# EAGLE design rc2014_rruart (EAGLE 8.1.1)
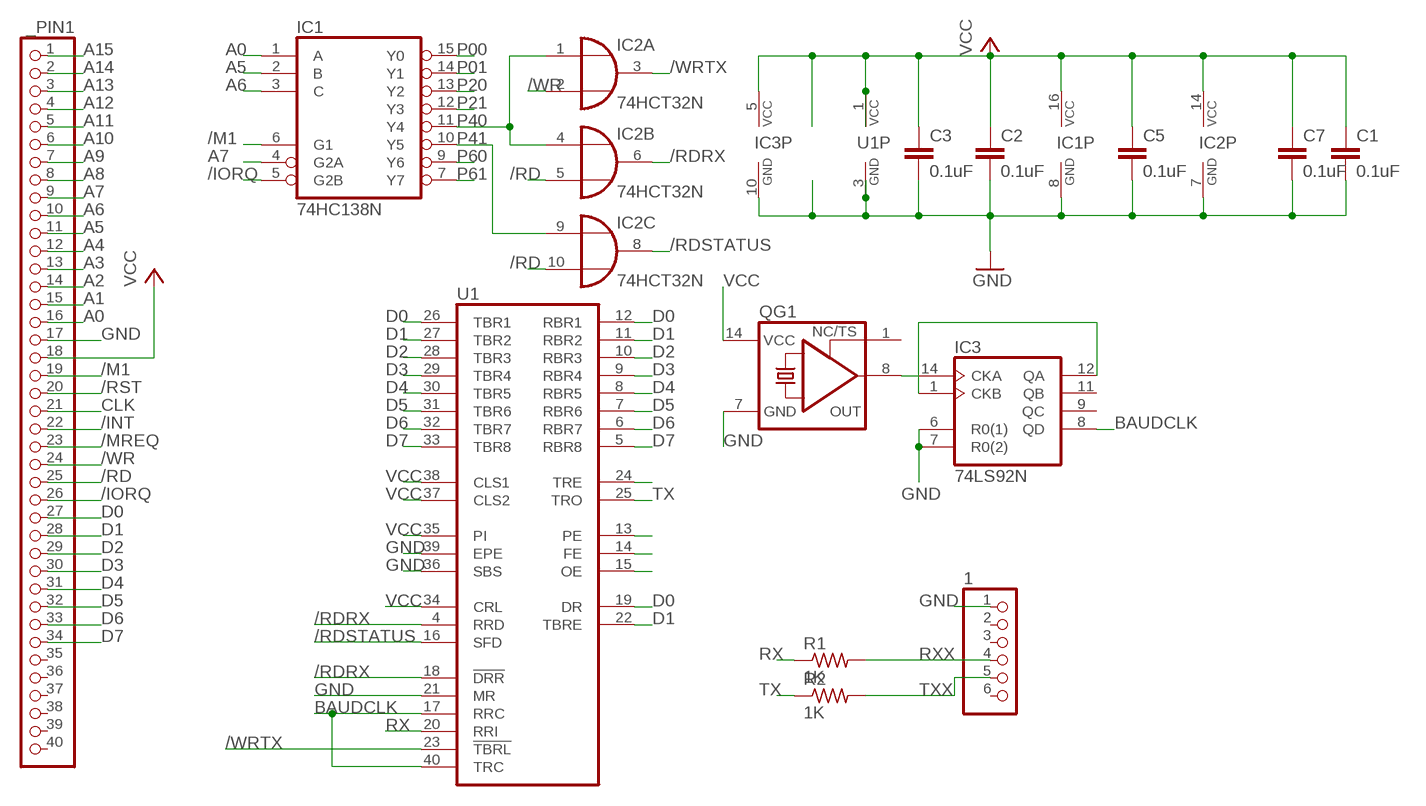
[diagram p0: schematic, sheet 1]

## Parts
1  PINHD-1X6  [1X06]
_PIN1  PINHD-1X40  [1X40]
C1  0.1uF  C-EU050-024X044  [C050-024X044]
C2  0.1uF  C-EU050-024X044  [C050-024X044]
C3  0.1uF  C-EU050-024X044  [C050-024X044]
C5  0.1uF  C-EU050-024X044  [C050-024X044]
C7  0.1uF  C-EU050-024X044  [C050-024X044]
IC1  74HC138N  [DIL16]
IC2  74HCT32N  [DIL14]
IC3  74LS92N  [DIL14]
QG1  XO-14  [DIL14S]
R1  1K  R-US_0207/10  [0207/10]
R2  1K  R-US_0207/10  [0207/10]
U1  HD6402  [DIL40]

## Nets
/INT: _PIN1.22
/IORQ: _PIN1.26 IC1.5(G2B)
/M1: _PIN1.19 IC1.6(G1)
/MREQ: _PIN1.23
/RD: _PIN1.25 IC2.5(B:I1) IC2.10(C:I1)
/RDRX: IC2.6(B:O) U1.4(RRD) U1.18(!DRR)
/RDSTATUS: IC2.8(C:O) U1.16(SFD)
/RST: _PIN1.20
/WR: _PIN1.24 IC2.2(A:I1)
/WRTX: IC2.3(A:O) U1.23(!TBRL)
A0: _PIN1.16 IC1.1(A)
A1: _PIN1.15
A2: _PIN1.14
A3: _PIN1.13
A4: _PIN1.12
A5: _PIN1.11 IC1.2(B)
A6: _PIN1.10 IC1.3(C)
A7: _PIN1.9 IC1.4(G2A)
A8: _PIN1.8
A9: _PIN1.7
A10: _PIN1.6
A11: _PIN1.5
A12: _PIN1.4
A13: _PIN1.3
A14: _PIN1.2
A15: _PIN1.1
BAUDCLK: IC3.8(QD) U1.17(RRC) U1.40(TRC)
CLK: _PIN1.21
D0: _PIN1.27 U1.12(RBR1) U1.19(DR) U1.26(TBR1)
D1: _PIN1.28 U1.11(RBR2) U1.22(TBRE) U1.27(TBR2)
D2: _PIN1.29 U1.10(RBR3) U1.28(TBR3)
D3: _PIN1.30 U1.9(RBR4) U1.29(TBR4)
D4: _PIN1.31 U1.8(RBR5) U1.30(TBR5)
D5: _PIN1.32 U1.7(RBR6) U1.31(TBR6)
D6: _PIN1.33 U1.6(RBR7) U1.32(TBR7)
D7: _PIN1.34 U1.5(RBR8) U1.33(TBR8)
GND: 1.1 _PIN1.17 C1.2 C2.2 C3.2 C5.2 C7.2 IC1.8(GND) IC2.7(P:GND) IC3.6(R0(1)) IC3.7(R0(2)) IC3.10(GND) QG1.7(GND) U1.3(GND) U1.21(MR) U1.36(SBS) U1.39(EPE)
N$2: IC3.14(CKA) QG1.8(OUT)
N$3: IC3.1(CKB) IC3.12(QA)
N$29: U1.15(OE)
N$30: U1.14(FE)
N$31: U1.13(PE)
N$33: U1.24(TRE)
P00: IC1.15(Y0)
P01: IC1.14(Y1)
P20: IC1.13(Y2)
P21: IC1.12(Y3)
P40: IC1.11(Y4) IC2.1(A:I0) IC2.4(B:I0)
P41: IC1.10(Y5) IC2.9(C:I0)
P60: IC1.9(Y6)
P61: IC1.7(Y7)
RX: R1.1 U1.20(RRI)
RXX: 1.4 R1.2
TX: R2.1 U1.25(TRO)
TXX: 1.5 R2.2
VCC: _PIN1.18 C1.1 C2.1 C3.1 C5.1 C7.1 IC1.16(VCC) IC2.14(P:VCC) IC3.5(VCC) QG1.14(VCC) U1.1(VCC) U1.34(CRL) U1.35(PI) U1.37(CLS2) U1.38(CLS1)
Unconnected: 1.2 1.3 1.6 _PIN1.35 _PIN1.36 _PIN1.37 _PIN1.38 _PIN1.39 _PIN1.40 IC2.11(D:O) IC2.12(D:I0) IC2.13(D:I1) IC3.9(QC) IC3.11(QB) QG1.1(TS)

## Library data of the parts
1 = pinhead:PINHD-1X6: PIN HEADER
_PIN1 = pinhead:PINHD-1X40: PIN HEADER
C1-C3 C5 C7 = rcl:C-EU: CAPACITOR, European symbol
IC1 = 74xx-eu:74*138: 3-line to 8-line DECODER/DEMULTIPLEXER
IC2 = 74xx-eu:74*32: Quad 2-input OR gate
IC3 = 74xx-eu:74*92: Decade, divide by twelve and binary COUNTER
QG1 = crystal:XO-: CRYSTAL; OC_FARNELL: unknown; OC_NEWARK: unknown
R1 R2 = resistor:R-US_: RESISTOR, American symbol
U1 = micro-harris:HD6402: MICROCONTROLLER/MEMORY DEVICE; OC_FARNELL: unknown; OC_NEWARK: unknown

## Net classes
0 +5V: width 0.508 mm

## Board
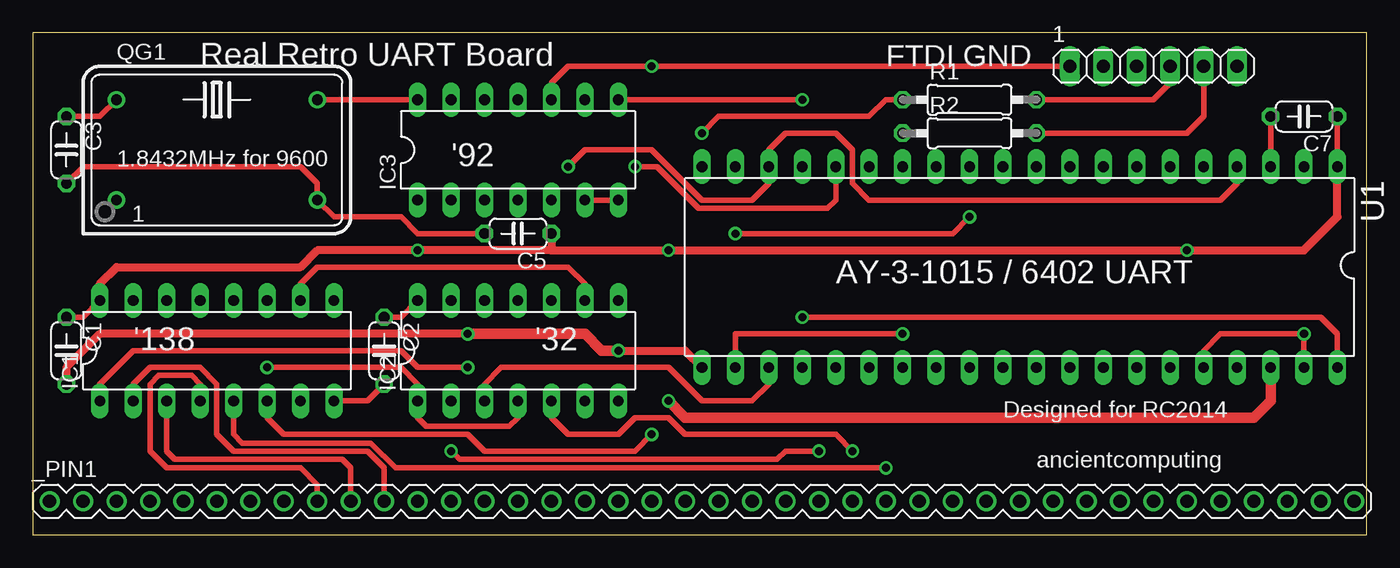
[diagram p1: board, top side]
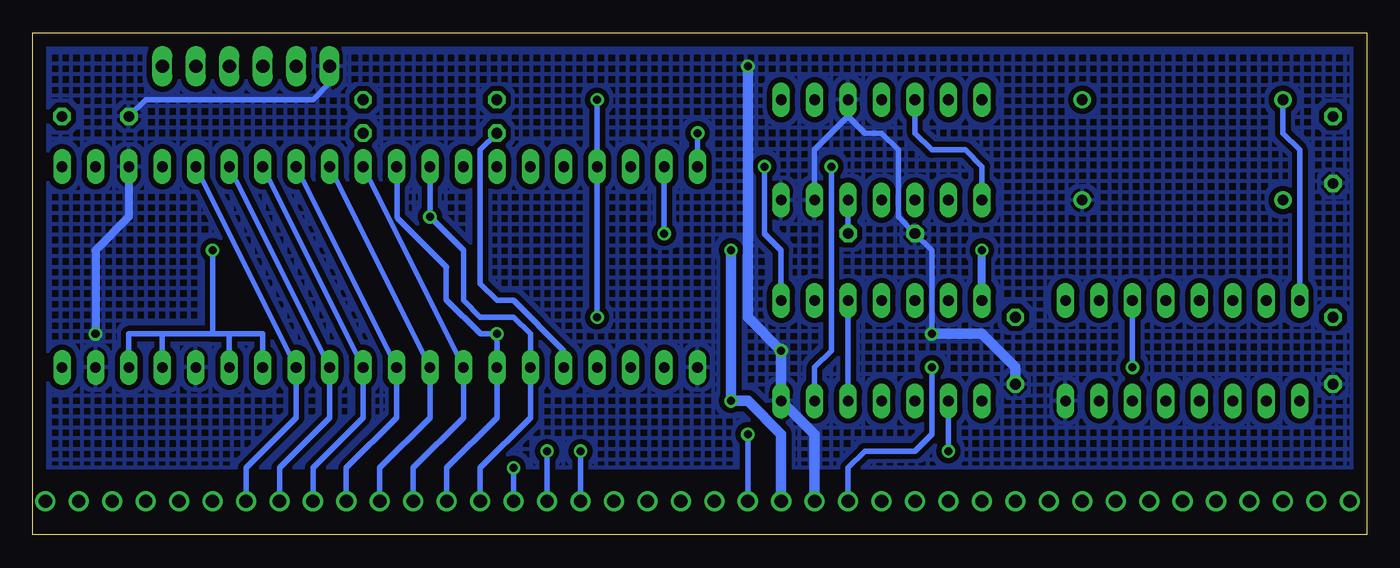
[diagram p2: board, bottom side, seen from below]

Size 101.27 x 38.09 mm. Coordinates in mm from the lower left corner, seen from the top.
Outline: 0,0 101.27,0 101.27,38.09 0,38.09 0,0
Copper layers (1*16): Top 0.035mm / dielectric 1.5mm / Bottom 0.035mm
Design rules "default *": minimum track width 20mil, minimum drill 24mil, track to track 8mil, track to pad 8mil, pad to pad 8mil, via to via 8mil, smd to smd 8mil, copper to edge 40mil, drill to drill 8mil, minimum pad ring 10mil, minimum via ring 8mil, stop-mask expansion 4mil, vias tented up to drill 0mil, thermal gap 10mil

### Footprints (pad centres in the part's own frame; a part is rotated, then mirrored left to right if it is on the bottom)
1X06 = drill 1.016 long: 1 -6.35,0; 2 -3.81,0; 3 -1.27,0; 4 1.27,0; 5 3.81,0; 6 6.35,0
1X40 = drill 1.016: 1 -49.53,0; 2 -46.99,0; 3 -44.45,0; 4 -41.91,0; 5 -39.37,0; 6 -36.83,0; 7 -34.29,0; 8 -31.75,0; 9 -29.21,0; 10 -26.67,0; 11 -24.13,0; 12 -21.59,0; 13 -19.05,0; 14 -16.51,0; 15 -13.97,0; 16 -11.43,0; 17 -8.89,0; 18 -6.35,0; 19 -3.81,0; 20 -1.27,0; 21 1.27,0; 22 3.81,0; 23 6.35,0; 24 8.89,0; 25 11.43,0; 26 13.97,0; 27 16.51,0; 28 19.05,0; 29 21.59,0; 30 24.13,0; 31 26.67,0; 32 29.21,0; 33 31.75,0; 34 34.29,0; 35 36.83,0; 36 39.37,0; 37 41.91,0; 38 44.45,0; 39 46.99,0; 40 49.53,0
C050-024X044 = drill 0.813 octagon: 1 -2.54,0; 2 2.54,0
DIL16 = drill 0.813 long: 1 -8.89,-3.81; 2 -6.35,-3.81; 3 -3.81,-3.81; 4 -1.27,-3.81; 5 1.27,-3.81; 6 3.81,-3.81; 7 6.35,-3.81; 8 8.89,-3.81; 9 8.89,3.81; 10 6.35,3.81; 11 3.81,3.81; 12 1.27,3.81; 13 -1.27,3.81; 14 -3.81,3.81; 15 -6.35,3.81; 16 -8.89,3.81
DIL14 = drill 0.813 long: 1 -7.62,-3.81; 2 -5.08,-3.81; 3 -2.54,-3.81; 4 0,-3.81; 5 2.54,-3.81; 6 5.08,-3.81; 7 7.62,-3.81; 8 7.62,3.81; 9 5.08,3.81; 10 2.54,3.81; 11 0,3.81; 12 -2.54,3.81; 13 -5.08,3.81; 14 -7.62,3.81
DIL14S = drill 0.813: 1 -7.62,-3.81; 7 7.62,-3.81; 8 7.62,3.81; 14 -7.62,3.81
0207/10 = drill 0.813 octagon: 1 -5.08,0; 2 5.08,0
DIL40 = drill 0.813 long: 1 -24.13,-7.62; 2 -21.59,-7.62; 3 -19.05,-7.62; 4 -16.51,-7.62; 5 -13.97,-7.62; 6 -11.43,-7.62; 7 -8.89,-7.62; 8 -6.35,-7.62; 9 -3.81,-7.62; 10 -1.27,-7.62; 11 1.27,-7.62; 12 3.81,-7.62; 13 6.35,-7.62; 14 8.89,-7.62; 15 11.43,-7.62; 16 13.97,-7.62; 17 16.51,-7.62; 18 19.05,-7.62; 19 21.59,-7.62; 20 24.13,-7.62; 21 24.13,7.62; 22 21.59,7.62; 23 19.05,7.62; 24 16.51,7.62; 25 13.97,7.62; 26 11.43,7.62; 27 8.89,7.62; 28 6.35,7.62; 29 3.81,7.62; 30 1.27,7.62; 31 -1.27,7.62; 32 -3.81,7.62; 33 -6.35,7.62; 34 -8.89,7.62; 35 -11.43,7.62; 36 -13.97,7.62; 37 -16.51,7.62; 38 -19.05,7.62; 39 -21.59,7.62; 40 -24.13,7.62

### Placement (x,y rotation side)
1  85.09,35.56 0 top
_PIN1  50.8,2.54 0 top
C1  2.54,13.97 270 top
C2  26.67,13.97 270 top
C3  2.54,29.21 270 top
C5  36.83,22.86 180 top
C7  96.52,31.75 180 top
IC1  13.97,13.97 0 top
IC2  36.83,13.97 0 top
IC3  36.83,29.21 0 top
QG1  13.97,29.21 0 top
R1  71.12,33.02 0 top
R2  71.12,30.48 0 top
U1  74.93,20.32 180 top

### Tracks (layer width: path | path; a pad name or v marks a point on that pad's centre or on a via)
/IORQ  (via drill 0.61)
  Top 0.406: v64.77,5.08 27.53,5.08 25.65,6.96 15.9,6.96 15.24,7.62 IC1.5
  Bottom 0.406: _PIN1.26 v64.77,5.08
/M1  (via drill 0.61)
  Top 0.406: 19.05,7.62 17.78,8.89 IC1.6 | 19.05,7.62 25.85,7.62 | v46.99,7.62 45.72,6.35 34.29,6.35 33.02,7.62 | 33.02,7.62 25.4,7.62 | 19.05,7.62 33.02,7.62
  Bottom 0.406: _PIN1.19 v46.99,7.62
/RD  (via drill 0.61)
  Top 0.406: IC2.5 39.37,8.89 40.64,7.62 44.45,7.62 45.72,8.89 46.99,8.89 | 46.99,8.89 48.26,8.89 | 46.99,8.89 48.26,8.89 | 48.26,8.89 49.53,7.62 60.96,7.62 v62.23,6.35
  Bottom 0.406: IC2.10 IC2.5 | v62.23,6.35 _PIN1.25
/RDRX  (via drill 0.61)
  Top 0.406: v40.64,27.94 41.91,29.21 46.99,29.21 50.8,25.4 54.61,25.4 55.88,26.67 U1.18 55.88,29.21 57.15,30.48 60.96,30.48 62.23,29.21 62.23,26.67 63.5,25.4 90.17,25.4 91.44,26.67 U1.4
  Bottom 0.406: IC2.6 41.91,12.7 40.64,13.97 v40.64,27.94
/RDSTATUS  (via drill 0.61)
  Top 0.406: v45.72,27.94 47.4,27.94 50.55,24.79 60.35,24.79 60.96,25.4 U1.16
  Bottom 0.406: IC2.8 44.45,21.59 45.72,22.86 v45.72,27.94
/WR  (via drill 0.61)
  Top 0.406: v31.75,6.35 32.38,5.71 56.52,5.71 57.15,6.35 v59.69,6.35 58.4,6.35
  Bottom 0.406: _PIN1.24 v59.69,6.35 | IC2.2 v31.75,6.35
/WRTX
  Top 0.406: IC2.3 34.29,11.43 35.56,12.7 48.26,12.7 50.8,10.16 54.61,10.16 55.88,11.43 U1.23
A0  (via drill 0.61)
  Top 0.406: IC1.1 5.08,11.43 7.62,13.97 27.94,13.97 29.21,12.7 v33.02,12.7
  Bottom 0.406: v33.02,12.7 33.02,7.62 34.29,6.35 38.1,6.35 39.37,5.08 _PIN1.16
A5
  Top 0.406: _PIN1.11 26.67,5.08 25.4,6.35 15.24,6.35 13.97,7.62 13.97,11.43 12.7,12.7 8.89,12.7 7.62,11.43 IC1.2
A6
  Top 0.406: _PIN1.10 24.13,5.08 23.47,5.74 10.77,5.74 10.16,6.35 IC1.3
A7
  Top 0.406: _PIN1.9 21.59,3.81 20.32,5.08 10.16,5.08 8.89,6.35 8.89,11.43 9.55,12.09 12.04,12.09 12.7,11.43 IC1.4
BAUDCLK  (via drill 0.61)
  Top 0.406: v58.42,16.51 97.79,16.51 99.06,15.24 U1.40 | IC3.8 v58.42,33.02
  Bottom 0.406: v58.42,16.51 U1.17 v58.42,33.02
D0  (via drill 0.61)
  Top 0.406: v53.34,22.86 69.85,22.86 v71.12,24.13
  Bottom 0.406: _PIN1.27 67.31,5.08 63.5,8.89 U1.26 63.5,15.24 64.77,16.51 67.31,16.51 68.58,17.78 68.58,21.59 v71.12,24.13 U1.12 | U1.19 v53.34,22.86
D1  (via drill 0.61)
  Top 0.406: v66.04,15.24 53.34,15.24 U1.22
  Bottom 0.406: _PIN1.28 69.85,5.08 66.04,8.89 U1.27 v66.04,15.24 67.27,15.24 69.89,17.85 69.89,20.28 69.85,20.32 73.57,24.04 73.62,24.15 73.62,27.9 U1.11
D2
  Bottom 0.406: _PIN1.29 72.39,5.08 68.58,8.89 U1.28 U1.10
D3
  Bottom 0.406: _PIN1.30 74.93,5.08 71.12,8.89 U1.29 U1.9
D4
  Bottom 0.406: _PIN1.31 77.47,5.08 73.66,8.89 U1.30 U1.8
D5
  Bottom 0.406: _PIN1.32 80.01,5.08 76.2,8.89 U1.31 U1.7
D6
  Bottom 0.406: _PIN1.33 82.55,5.08 78.74,8.89 U1.32 U1.6
D7
  Bottom 0.406: _PIN1.34 85.09,5.08 81.28,8.89 U1.33 U1.5
GND  (via drill 0.61)
  Top 0.406: IC1.8 25.4,10.16 C2.2 | IC3.6 IC3.7 | C7.2 U1.3 | C3.2 3.81,27.94 20.32,27.94 21.59,26.67 QG1.7 22.86,24.13 27.94,24.13 29.21,22.86 C5.2 | U1.36 88.9,13.97 90.17,15.24 v96.52,15.24 U1.39 | IC3.10 39.37,34.29 40.64,35.56 v46.99,35.56 1.1
  Top 0.61: v44.45,13.97 49.53,13.97 U1.21 | C1.2 2.54,12.7 5.08,15.24 v33.02,15.24
  Top 0.813: v33.02,15.24 41.91,15.24 43.18,13.97 v44.45,13.97
  Bottom 0.406: v33.02,15.24 33.02,21.59 C5.2 35.56,24.13 35.56,29.21 36.83,30.48 38.1,30.48 39.37,31.75 | 39.37,31.75 IC3.10 | IC3.6 41.91,29.21 39.37,31.75 | C7.2 92.71,33.02 80.01,33.02 78.74,34.29 1.1
  Bottom 0.61: U1.3 93.98,24.13 96.52,21.59 v96.52,15.24
  Bottom 0.813: _PIN1.17 41.91,7.62 IC2.7 v44.45,13.97 46.99,16.51 v46.99,35.56 | C2.2 26.67,12.7 29.21,15.24 v33.02,15.24
  pour Bottom (isolate 0.406, hatched): 0,38.1 0,5.08 101.6,5.08 101.6,38.1
N$2
  Top 0.406: QG1.8 IC3.14
N$3
  Bottom 0.406: IC3.1 29.21,27.94 30.48,29.21 33.02,29.21 34.29,30.48 IC3.12
P40  (via drill 0.61)
  Top 0.406: IC2.4 36.83,8.89 36.17,8.23 29.87,8.23 29.21,8.89 IC2.1 29.21,11.43 27.94,12.7 v17.78,12.7
  Bottom 0.406: IC1.11 v17.78,12.7
P41
  Top 0.406: IC2.9 41.91,19.05 40.64,20.32 21.59,20.32 20.32,19.05 IC1.10
RX  (via drill 0.61)
  Top 0.406: v50.8,30.48 52.07,31.75 63.5,31.75 64.77,33.02 R1.1
  Bottom 0.406: U1.20 v50.8,30.48
RXX
  Top 0.406: R1.2 85.09,33.02 86.36,34.29 1.4
TX
  Bottom 0.406: U1.25 60.96,13.97 64.77,17.78 66.04,17.78 67.31,19.05 67.31,29.21 R2.1
TXX
  Top 0.406: R2.2 87.63,30.48 88.9,31.75 1.5
VCC  (via drill 0.61)
  Top 0.406: C1.1 3.81,16.51 IC1.16 | C2.1 27.94,16.51 IC2.14 | U1.1 C7.1 | C3.1 5.08,31.75 QG1.14
  Top 0.61: IC1.16 5.08,19.05 6.35,20.32 20.32,20.32 21.59,21.59 v29.21,21.59 39.37,21.59 | 39.37,21.59 v48.26,21.59 v87.63,21.59 96.52,21.59 99.06,24.13 U1.1 | C5.1 39.37,21.59
  Top 0.813: v48.26,10.16 49.53,8.89 92.71,8.89 93.98,10.16 U1.38
  Bottom 0.406: C5.1 IC3.5 | U1.38 93.98,15.24 91.44,15.24 | U1.34 83.82,15.24 86.36,15.24 | 87.63,15.24 86.36,15.24 | 87.63,15.24 91.44,15.24 | 86.36,15.24 U1.35 | 91.44,15.24 U1.37 | QG1.14 6.35,30.48 5.08,29.21 IC1.16 | v87.63,21.59 87.63,15.24
  Bottom 0.61: IC2.14 v29.21,21.59
  Bottom 0.813: _PIN1.18 44.45,7.62 46.99,10.16 v48.26,10.16 v48.26,21.59

### Text on the board
tNames: Real Retro UART Board | FTDI GND | 1.8432MHz for 9600 | '92 | AY-3-1015 / 6402 UART | '138 | '32 | Designed for RC2014 | ancientcomputing